# Altium schematic sheet gydrodrive_reservedPins.SchDoc
size 297 x 209 mm; SheetNumber: 21; SheetTotal: 22
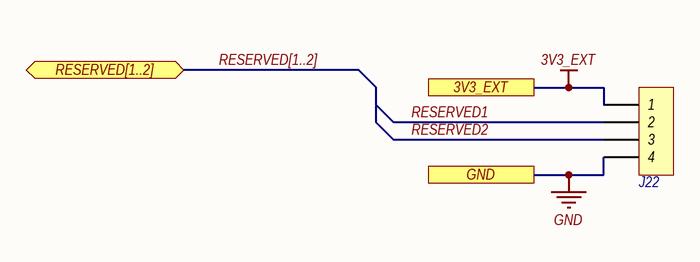
[diagram p0: gydrodrive_reservedPins.SchDoc]

## Parts
J22  DG142V-5.08-04P  [DG142V-5.08-04P]  (value not drawn)

## Ports
3V3_EXT (see gydrodrive_main[4C], gydrodrive_i2c[5B], gydrodrive_interfaces[3A], gydrodrive_supply[5B], gydrodrive_uart[4B]), GND (see gydrodrive_main[4C], gydrodrive_button[3C], gydrodrive_can[3C], gydrodrive_control[3B], gydrodrive_currentSource[2B], gydrodrive_debugger[4C], gydrodrive_discreteControl[3B], gydrodrive_encoder[1B], gydrodrive_i2c[5C], gydrodrive_indication[4C], gydrodrive_inputTrim[4C], gydrodrive_interfaces[3A], gydrodrive_linearPosSensor[2C], gydrodrive_mcu[6D], gydrodrive_rs485[3B], gydrodrive_sensor[3C], gydrodrive_sensors[2B], gydrodrive_sto[3C], gydrodrive_supply[2C], gydrodrive_uart[4C]), RESERVED[1..2] (bidir, see gydrodrive_main[3C], gydrodrive_mcu[1A])

## Nets
3V3_EXT: J22.1 ; port 3V3_EXT
GND: J22.4 ; port GND
RESERVED1: J22.2
RESERVED2: J22.3

## Buses and harness runs
bus RESERVED[1..2] = port RESERVED[1..2]

## Notes on the sheet
- Подп. и дата
- Инв. № дубл.
- Взам. инв. №
- Инв. № подл.
- Изм.
- Лист
- № докум.
- Подп.
- Дата
- Копировал
- Формат
- A4

## Library data of the parts
J22 = DG142V-5.08-04P: Клеммник 4-контактный, шаг 5.08 мм; Part Name: Клеммник DG142V-5.08-04P; Parameters: 8А; Max Price: 60; System: Connector; Part Number: DG142V-5.08-04P; Component Type: Standart; Pin Count: 4